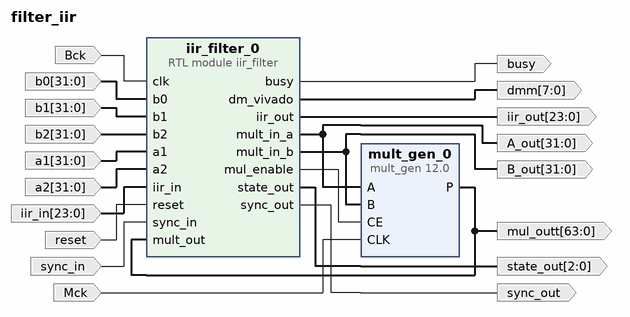
[diagram p0: block diagram of the top level]
# Vivado block design filter_iir, xc7z010clg400-1, Vivado 2024.2
create_bd_design filter_iir

create_bd_port -dir I -type clk Bck
set_property -dict {CONFIG.FREQ_HZ 100000000} [get_bd_ports Bck]
create_bd_port -dir I -type clk Mck
set_property -dict {CONFIG.FREQ_HZ 100000000} [get_bd_ports Mck]
create_bd_port -dir I -from 23 -to 0 -type data iir_in
create_bd_port -dir O -from 23 -to 0 -type data iir_out
create_bd_port -dir O -type data sync_out
create_bd_port -dir O -type data busy
create_bd_port -dir I -type data sync_in
create_bd_port -dir I -type rst reset
set_property -dict {CONFIG.POLARITY ACTIVE_HIGH} [get_bd_ports reset]
create_bd_port -dir I -from 31 -to 0 -type data b0
create_bd_port -dir I -from 31 -to 0 -type data b1
create_bd_port -dir I -from 31 -to 0 -type data b2
create_bd_port -dir I -from 31 -to 0 -type data a1
create_bd_port -dir I -from 31 -to 0 -type data a2
create_bd_port -dir O -from 63 -to 0 -type data mul_outt
create_bd_port -dir O -from 31 -to 0 -type data A_out
create_bd_port -dir O -from 31 -to 0 -type data B_out
create_bd_port -dir O -from 7 -to 0 -type data dmm
create_bd_port -dir O -from 2 -to 0 -type data state_out

create_bd_cell -type module -reference iir_filter iir_filter_0
create_bd_cell -type ip -vlnv xilinx.com:ip:mult_gen:12.0 mult_gen_0
set_property -dict [list \
  CONFIG.ClockEnable true \
  CONFIG.MultType Parallel_Multiplier \
  CONFIG.Multiplier_Construction Use_Mults \
  CONFIG.PipeStages 6 \
  CONFIG.PortAWidth 32 \
  CONFIG.PortBWidth 32 \
] [get_bd_cells mult_gen_0]

# ---- connections ----

connect_bd_net [get_bd_ports Bck] [get_bd_pins iir_filter_0/clk]
connect_bd_net [get_bd_ports Mck] [get_bd_pins mult_gen_0/CLK]
connect_bd_net -net a0_1 [get_bd_ports b0] [get_bd_pins iir_filter_0/b0]
connect_bd_net -net a1_1 [get_bd_ports b1] [get_bd_pins iir_filter_0/b1]
connect_bd_net -net a2_1 [get_bd_ports b2] [get_bd_pins iir_filter_0/b2]
connect_bd_net -net b1_1 [get_bd_ports a1] [get_bd_pins iir_filter_0/a1]
connect_bd_net -net b2_1 [get_bd_ports a2] [get_bd_pins iir_filter_0/a2]
connect_bd_net [get_bd_pins iir_filter_0/busy] [get_bd_ports busy]
connect_bd_net [get_bd_pins iir_filter_0/dm_vivado] [get_bd_ports dmm]
connect_bd_net [get_bd_pins iir_filter_0/iir_out] [get_bd_ports iir_out]
connect_bd_net [get_bd_pins iir_filter_0/mul_enable] [get_bd_pins mult_gen_0/CE]
connect_bd_net [get_bd_pins iir_filter_0/mult_in_a] [get_bd_pins mult_gen_0/A] [get_bd_ports A_out]
connect_bd_net [get_bd_pins iir_filter_0/mult_in_b] [get_bd_pins mult_gen_0/B] [get_bd_ports B_out]
connect_bd_net [get_bd_pins iir_filter_0/state_out] [get_bd_ports state_out]
connect_bd_net [get_bd_pins iir_filter_0/sync_out] [get_bd_ports sync_out]
connect_bd_net [get_bd_ports iir_in] [get_bd_pins iir_filter_0/iir_in]
connect_bd_net [get_bd_pins mult_gen_0/P] [get_bd_ports mul_outt] [get_bd_pins iir_filter_0/mult_out]
connect_bd_net [get_bd_ports reset] [get_bd_pins iir_filter_0/reset]
connect_bd_net [get_bd_ports sync_in] [get_bd_pins iir_filter_0/sync_in]

validate_bd_design
save_bd_design
